# EasyEDA schematic SCH_LEDChaser555_2024-04-30.json
TITLE: Sheet_1; REV: 1.0; Date: 2024-04-22; Sheet: 1/1; Drawn By: ABHCI15; Company: Canyon Crest Academy
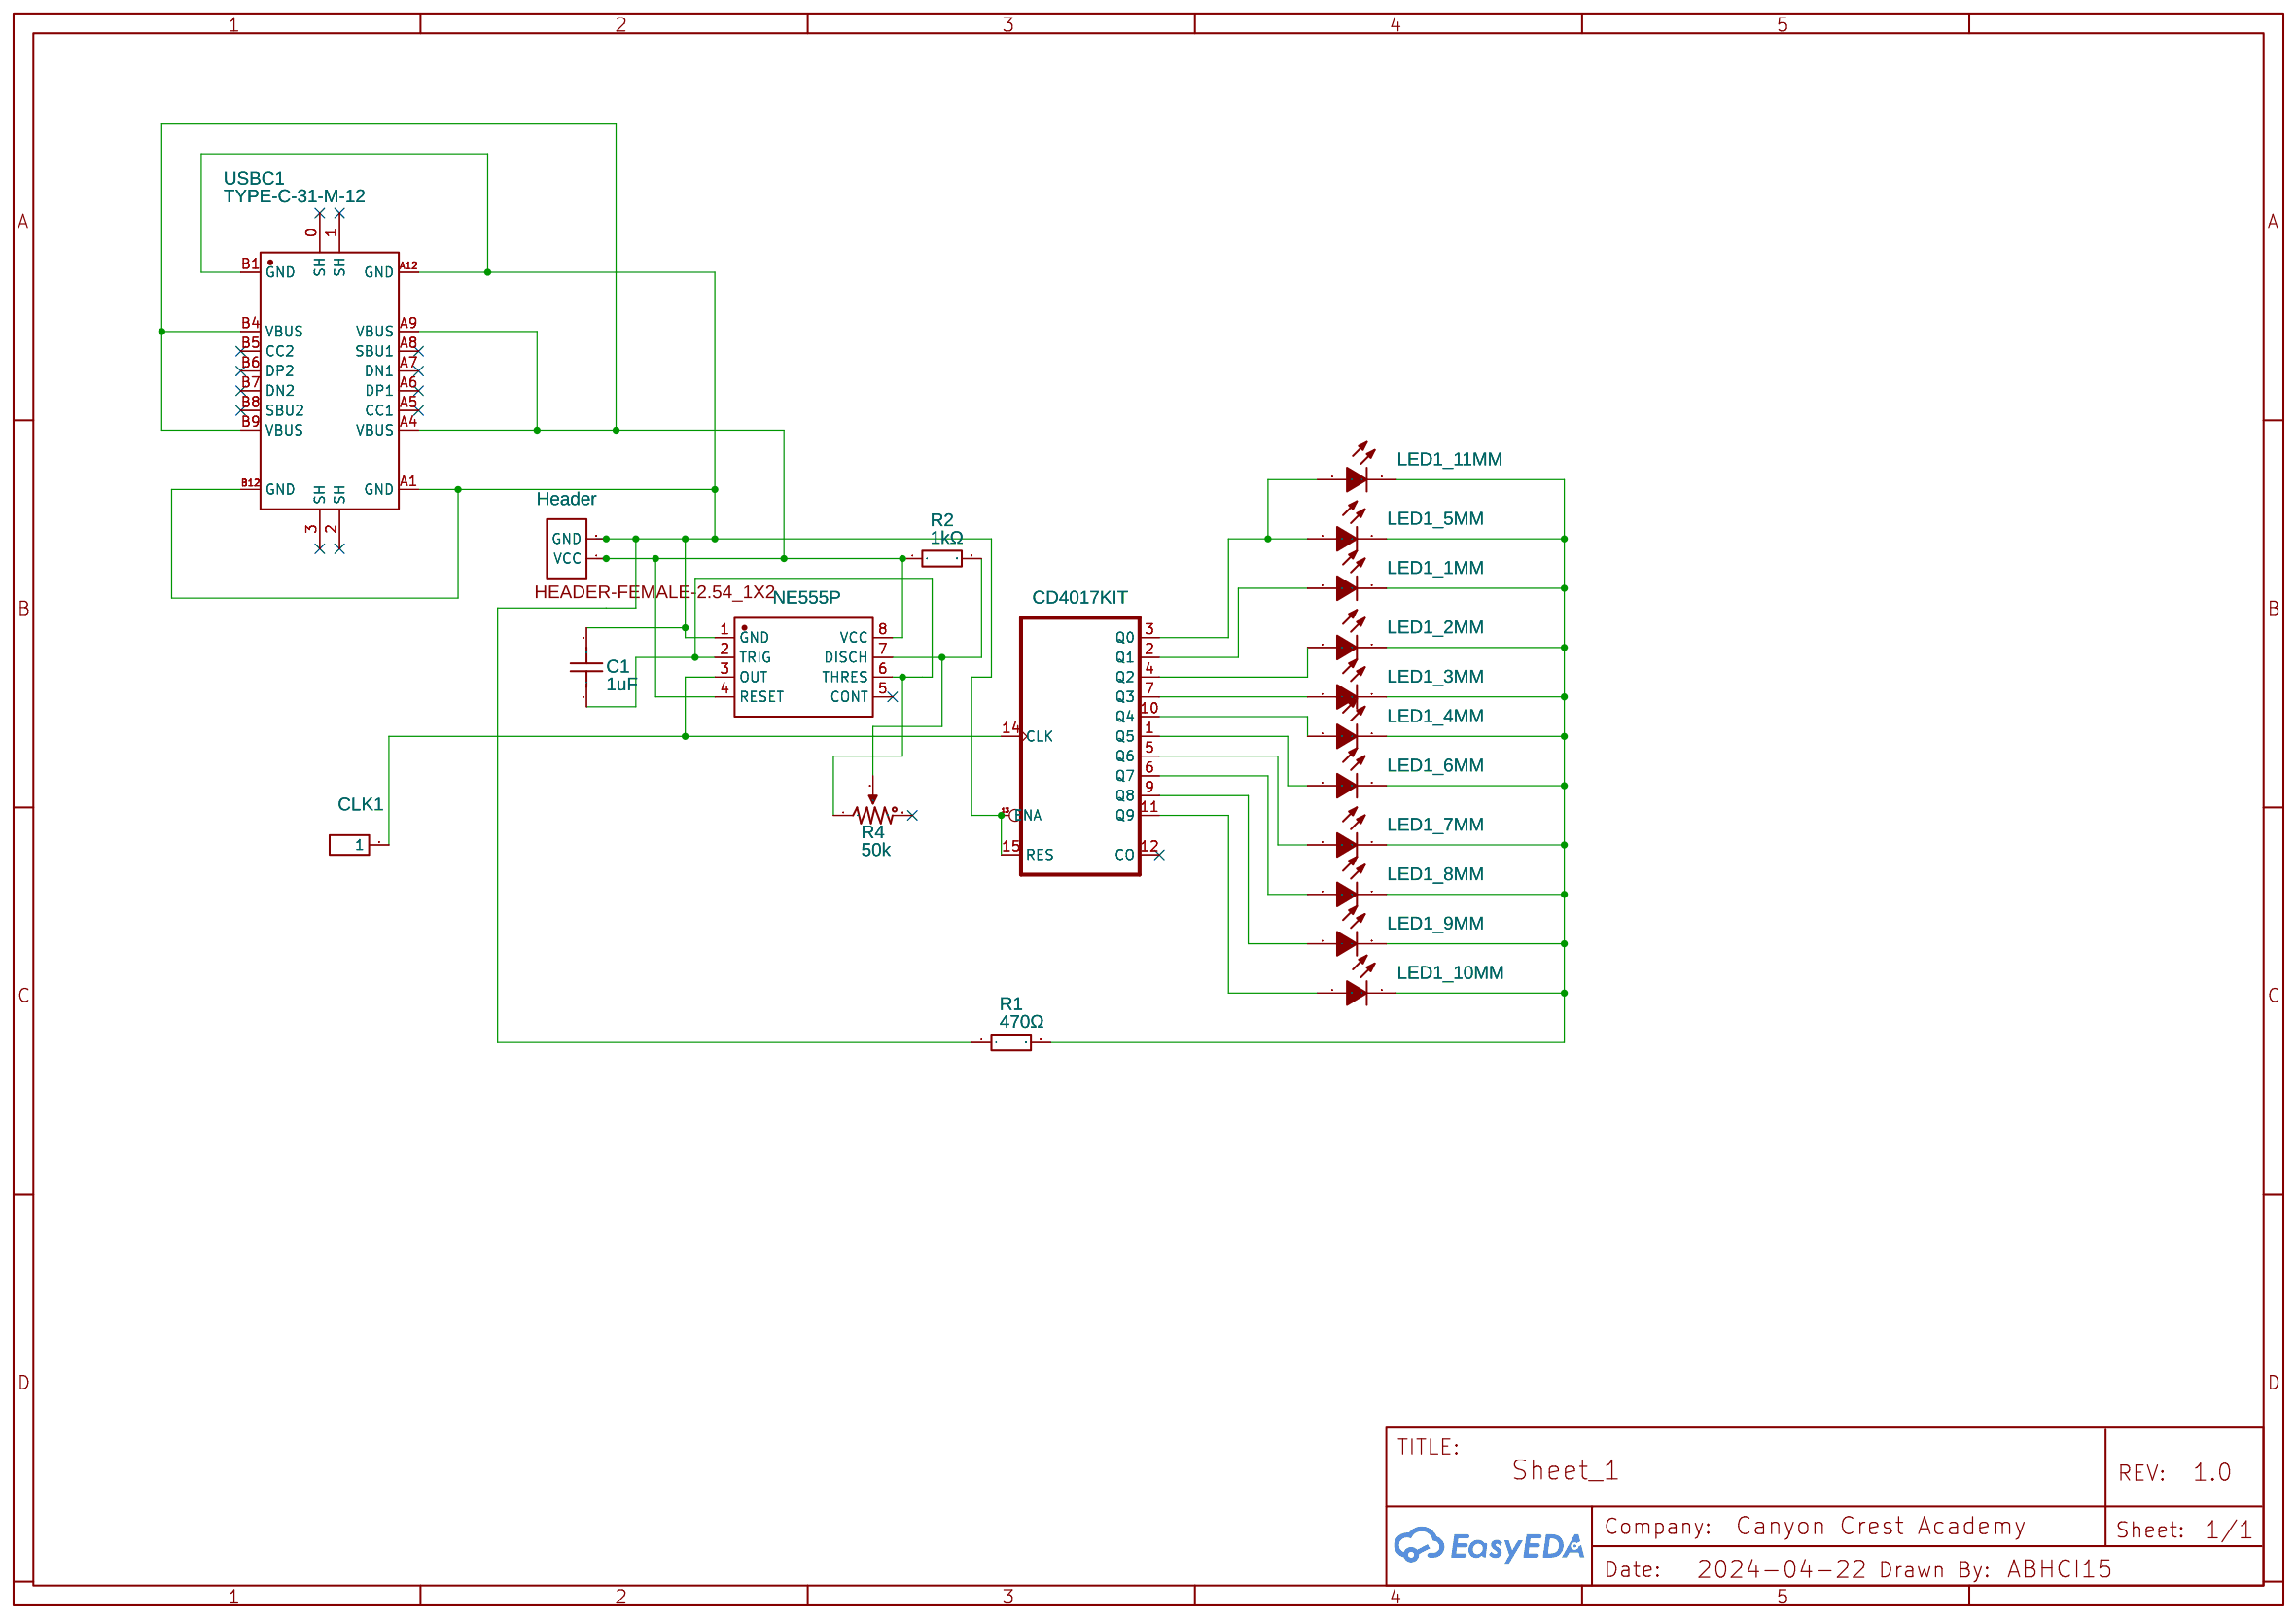
[diagram p0: schematic sheet]

## Parts
C1  1uF  [C1206]
CLK1  C81276  [HDR-TH_1P-P2.54-V-M]
H1  Header  [HEADER-FEMALE-2.54_1X2]
LED1_1MM  LED_5MM  [LED-TH_BD5.0-P2.54-FD_C9900023552]
LED1_2MM  LED_5MM  [LED-TH_BD5.0-P2.54-FD_C9900023552]
LED1_3MM  LED_5MM  [LED-TH_BD5.0-P2.54-FD_C9900023552]
LED1_4MM  LED_5MM  [LED-TH_BD5.0-P2.54-FD_C9900023552]
LED1_5MM  LED_5MM  [LED-TH_BD5.0-P2.54-FD_C9900023552]
LED1_6MM  LED_5MM  [LED-TH_BD5.0-P2.54-FD_C9900023552]
LED1_7MM  LED_5MM  [LED-TH_BD5.0-P2.54-FD_C9900023552]
LED1_8MM  LED_5MM  [LED-TH_BD5.0-P2.54-FD_C9900023552]
LED1_9MM  LED_5MM  [LED-TH_BD5.0-P2.54-FD_C9900023552]
LED1_10MM  LED_5MM  [LED-TH_BD5.0-P2.54-FD_C9900023552]
LED1_11MM  LED_5MM  [LED-TH_BD5.0-P2.54-FD_C9900023552]
R1  470Ω  [R0603]
R2  1kΩ  [R1206]
R4  50k  [RES-ADJ_3296X]
U1  CD4017KIT  [DIP-16]  (section 1)
U2  NE555P  [DIP-8_L9.8-W6.6-P2.54-LS7.6-BL]
USBC1  TYPE-C-31-M-12  [USB-C_SMD-TYPE-C-31-M-12]

## Library data of the parts
C1 = CL31B105KBHNNNE: Supplier: LCSC; Manufacturer: SAMSUNG(三星); Supplier Part: C1848; JLCPCB Part Class: Basic Part
CLK1 = Header-Male-2.54_1x1: Supplier: LCSC; Manufacturer Part: 2.54-1*1P针; JLCPCB Part Class: Extended Part; Package Display: No; Manufacturer: BOOMELE(Boom Precision Elec); Contributor: Thejo Prakash
H1 = HEADER-FEMALE-2.54_1X2: Contributor: nonstop2004; Supplier: LCSC; Supplier Part: C492401; Package Display: Yes
LED1_1MM LED1_2MM LED1_3MM LED1_4MM LED1_5MM LED1_6MM LED1_7MM LED1_8MM LED1_9MM LED1_10MM LED1_11MM = LED_5MM: Contributor: lcsc; Supplier: LCSC; Supplier Part: C2992663
R1 = 0603WAF4700T5E: Supplier: LCSC; Manufacturer: UNI-ROYAL(厚声); Supplier Part: C23179; JLCPCB Part Class: Basic Part
R2 = 1206W4F1001T5E: Supplier: LCSC; Manufacturer: UNI-ROYAL(厚声); Supplier Part: C4410; JLCPCB Part Class: Basic Part
R4 = Potentiometer: K(%): 50; Supplier: LCSC; Supplier Part: C118912
U1 = CD4017KIT: Contributor: SparkFun; Supplier: LCSC; Supplier Part: C34519
U2 = NE555P: Supplier: LCSC; Manufacturer: TI(德州仪器); Supplier Part: C46749; JLCPCB Part Class: Extended Part
USBC1 = TYPE-C-31-M-12: Contributor: LCSC; Supplier: LCSC; Supplier Part: C165948; Manufacturer: 韩国韩荣; JLCPCB Part Class: Extended Part

## Nets
Net-(C1-1): C1.1 R4.1 U2.2(TRIG) U2.6(THRES)
Net-(C1-2): C1.2 H1.2(GND) R1.1 U1.13(ENA) U1.15(RES) U2.1(GND) USBC1.A1(GND) USBC1.A12(GND) USBC1.B1(GND) USBC1.B12(GND)
Net-(CLK1-1): CLK1.1 U1.14(CLK) U2.3(OUT)
Net-(H1-1): H1.1(VCC) R2.1 U2.4(RESET) U2.8(VCC) USBC1.A4(VBUS) USBC1.A9(VBUS) USBC1.B4(VBUS) USBC1.B9(VBUS)
Net-(LED1_1MM-1): LED1_1MM.1(A) U1.2(Q1)
Net-(LED1_1MM-2): LED1_1MM.2(K) LED1_2MM.2(K) LED1_3MM.2(K) LED1_4MM.2(K) LED1_5MM.2(K) LED1_6MM.2(K) LED1_7MM.2(K) LED1_8MM.2(K) LED1_9MM.2(K) LED1_10MM.2(K) LED1_11MM.2(K) R1.2
Net-(LED1_2MM-1): LED1_2MM.1(A) U1.4(Q2)
Net-(LED1_3MM-1): LED1_3MM.1(A) U1.7(Q3)
Net-(LED1_4MM-1): LED1_4MM.1(A) U1.10(Q4)
Net-(LED1_5MM-1): LED1_5MM.1(A) LED1_11MM.1(A) U1.3(Q0)
Net-(LED1_6MM-1): LED1_6MM.1(A) U1.1(Q5)
Net-(LED1_7MM-1): LED1_7MM.1(A) U1.5(Q6)
Net-(LED1_8MM-1): LED1_8MM.1(A) U1.6(Q7)
Net-(LED1_9MM-1): LED1_9MM.1(A) U1.9(Q8)
Net-(LED1_10MM-1): LED1_10MM.1(A) U1.11(Q9)
Net-(R2-2): R2.2 R4.2(3) U2.7(DISCH)

Not connected (* = marked no-connect by the designer): R4 3(2)*; U1 12(CO)*; U2 5(CONT)*; USBC1 0(SH)* 1(SH)* 2(SH)* 3(SH)* A5(CC1)* A6(DP1)* A7(DN1)* A8(SBU1)* B5(CC2)* B6(DP2)* B7(DN2)* B8(SBU2)*
